# EAGLE schematic BMBurner V1.0 (EAGLE 8.4.0)
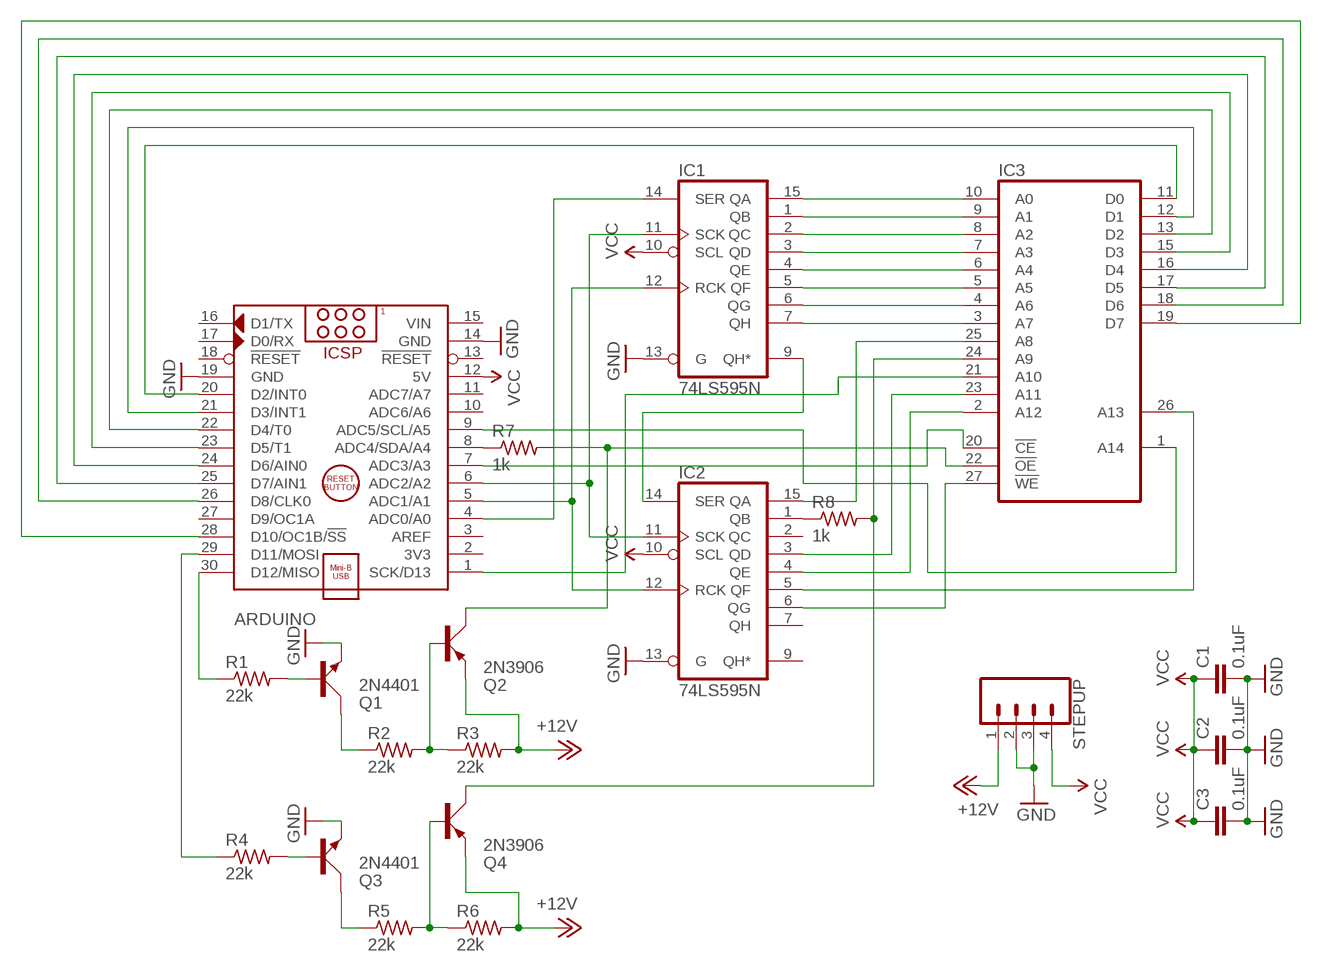
[diagram p0: schematic, sheet 1]

## Parts
ARDUINO  ARDUINO_NANO  [ARDUINO_NANO]
C1  0.1uF  CAPPTH  [CAP-PTH-SMALL]
C2  0.1uF  CAPPTH  [CAP-PTH-SMALL]
C3  0.1uF  CAPPTH  [CAP-PTH-SMALL]
IC1  74LS595N  [DIL16]
IC2  74LS595N  [DIL16]
IC3  2864  [DIL28]
Q1  2N4401  2N2222  [TO18A]
Q2  2N3906  [TO92D]
Q3  2N4401  2N2222  [TO18A]
Q4  2N3906  [TO92D]
R1  22k  R-US_0207/10  [0207/10]
R2  22k  R-US_0207/10  [0207/10]
R3  22k  R-US_0207/10  [0207/10]
R4  22k  R-US_0207/10  [0207/10]
R5  22k  R-US_0207/10  [0207/10]
R6  22k  R-US_0207/10  [0207/10]
R7  1k  R-US_0207/10  [0207/10]
R8  1k  R-US_0207/10  [0207/10]
STEPUP  CONN_04  [1X04]

## Nets
+12V: Q2.E Q4.E R3.2 R6.2 STEPUP.1
GND: ARDUINO.14(GND) ARDUINO.19(GND) C1.2 C2.2 C3.2 IC1.13(G) IC2.13(G) Q1.E Q3.E STEPUP.2 STEPUP.3
N$1: ARDUINO.7(ADC3/A3) IC3.20(!CE)
N$2: ARDUINO.29(D11/MOSI) R4.1
N$3: ARDUINO.6(ADC2/A2) IC1.11(SCK) IC2.11(SCK)
N$4: IC2.4(QE) IC3.2(A12)
N$5: ARDUINO.9(ADC5/SCL/A5) IC3.1(A14)
N$6: IC3.22(!OE) Q2.C R7.2
N$7: IC2.6(QG) IC3.27(!WE)
N$8: Q1.C R2.1
N$9: ARDUINO.1(SCK/D13) IC3.21(A10)
N$10: ARDUINO.30(D12/MISO) R1.1
N$11: Q3.C R5.1
N$37: ARDUINO.8(ADC4/SDA/A4) R7.1
N$39: Q1.B R1.2
N$45: Q2.B R2.2 R3.1
N$46: Q3.B R4.2
N$48: Q4.B R5.2 R6.1
N$52: IC3.24(A9) Q4.C R8.2
N$53: IC2.1(QB) R8.1
N$54: IC2.15(QA) IC3.25(A8)
N$57: ARDUINO.5(ADC1/A1) IC1.12(RCK) IC2.12(RCK)
N$58: ARDUINO.4(ADC0/A0) IC1.14(SER)
N$59: IC1.9(QH*) IC2.14(SER)
N$60: ARDUINO.20(D2/INT0) IC3.11(D0)
N$61: ARDUINO.21(D3/INT1) IC3.12(D1)
N$62: ARDUINO.22(D4/T0) IC3.13(D2)
N$63: ARDUINO.23(D5/T1) IC3.15(D3)
N$64: ARDUINO.24(D6/AIN0) IC3.16(D4)
N$65: ARDUINO.25(D7/AIN1) IC3.17(D5)
N$66: ARDUINO.26(D8/CLK0) IC3.18(D6)
N$67: ARDUINO.28(D10/OC1B/!SS) IC3.19(D7)
N$68: IC1.15(QA) IC3.10(A0)
N$69: IC1.1(QB) IC3.9(A1)
N$70: IC1.2(QC) IC3.8(A2)
N$71: IC1.3(QD) IC3.7(A3)
N$72: IC1.4(QE) IC3.6(A4)
N$73: IC1.5(QF) IC3.5(A5)
N$74: IC1.6(QG) IC3.4(A6)
N$75: IC1.7(QH) IC3.3(A7)
N$76: IC2.3(QD) IC3.23(A11)
N$80: IC2.5(QF) IC3.26(A13)
VCC: ARDUINO.12(5V) C1.1 C2.1 C3.1 IC1.10(SCL) IC2.10(SCL) STEPUP.4
Unconnected: ARDUINO.2(3V3) ARDUINO.3(AREF) ARDUINO.10(ADC6/A6) ARDUINO.11(ADC7/A7) ARDUINO.13(!RESET) ARDUINO.16(D1/TX) ARDUINO.17(D0/RX) ARDUINO.18(!RESET) ARDUINO.27(D9/OC1A) IC2.2(QC) IC2.7(QH) IC2.9(QH*)

## Power pins joined to a net without a drawn wire
GND: IC1.8(GND) IC2.8(GND) IC3.14(GND)
VCC: IC1.16(VCC) IC2.16(VCC) IC3.28(VCC)
VIN: ARDUINO.15(VIN)

## Library data of the parts
ARDUINO = ArduinoNanoV30:ARDUINO_NANO: Arduino Nano V3.0 Module Overview: The Arduino Nano is a small, complete, and breadboard-friendly board based on the ATmega328 (Arduino Nano 3.x) or ATmega168 (Arduino Nano 2.x). It has more or less the same functionality of the Arduino Duemilanove, but in a different package. It lacks only a DC power jack, and works with a Mini-B USB cable instead of a standard one. The Nano was designed and is being produced by Gravitech <http://www.gravitech.us/arna30wiatp.html>. General specifications: Item Value Microcontroller Atmel ATmega168 or ATmega328 Operating Voltage (logic level) 5 V Input Voltage (recommended) 7-12 V Input Voltage (limits) 6-20 V Digital I/O Pins 14 (of which 6 provide PWM output) Analog Input Pins 8 DC Current per I/O Pin 40 mA Flash Memory 16 KB (ATmega168) or 32 KB (ATmega328) of which 2 KB used by bootloader SRAM 1 KB (ATmega168) or 2 KB (ATmega328) EEPROM 512 bytes (ATmega168) or 1 KB (ATmega328) Clock Speed 16 MHz Dimensions (Inches) 0.73" x 1.70" Dimensions (mm) 18mm x 45mm Overall height About 9 mm (not including pins) Weigth 5 g Power: The Arduino Nano can be powered via the Mini-B USB connection, 6-20V unregulated external power supply (pin 30), or 5V regulated external power supply (pin 27). The power source is automatically selected to the highest voltage source. Memory: The ATmega168 has 16 KB of flash memory for storing code (of which 2 KB is used for the bootloader); the ATmega328 has 32 KB, (also with 2 KB used for the bootloader). The ATmega168 has 1 KB of SRAM and 512 bytes of EEPROM (which can be read and written with the EEPROM library); the ATmega328 has 2 KB of SRAM and 1 KB of EEPROM. Input and Output: Each of the 14 digital pins on the Nano can be used as an input or output, using pinMode(), digitalWrite(), and digitalRead() functions. They operate at 5 volts. Each pin can provide or receive a maximum of 40 mA and has an internal pull-up resistor (disconnected by default) of 20-50 kOhms. In addition, some pins have specialized functions. Visit Arduino - ArduinoBoardNano <https://www.arduino.cc/en/Main/ArduinoBoardNano>
C1-C3 = SparkFun:CAP: Capacitor Standard 0603 ceramic capacitor, and 0.1" leaded capacitor.
IC1 IC2 = 74xx-us:74*595: 8-bit SHIFT REGISTER, output latch; SPICEPREFIX: X
IC3 = modded_memory:2864: MEMORY
Q1 Q3 = transistor-small-signal:2N2222: NPN TRANSISTOR
Q2 Q4 = transistor-small-signal:2N3906: PNP TRANSISTOR
R1 = resistor:R-US_: RESISTOR, American symbol; SPICEPREFIX: R
R2-R8 = resistor:R-US_: RESISTOR, American symbol
STEPUP = SparkFun-Connectors:CONN_04: Multi connection point. Often used as Generic Header-pin footprint for 0.1 inch spaced/style header connections On any of the 0.1 inch spaced packages, you can populate with these: Break Away Headers - Straight <https://www.sparkfun.com/products/116> (PRT-00116) Break Away Male Headers - Right Angle <https://www.sparkfun.com/products/553> (PRT-00553) Female Headers <https://www.sparkfun.com/products/115> (PRT-00115) Break Away Headers - Machine Pin <https://www.sparkfun.com/products/117> (PRT-00117) Break Away Female Headers - Swiss Machine Pin <https://www.sparkfun.com/products/743> (PRT-00743) For SCREWTERMINALS and SPRING TERMINALS visit here: Screw Terimnals on SparkFun.com <https://www.sparkfun.com/search/results?term=Screw+Terminals> (5mm/3.5mm/2.54mm spacing) This device is also useful as a general connection point to wire up your design to another part of your project. Our various solder wires solder well into these plated through hole pads. Hook-Up Wire - Assortment (Stranded, 22 AWG) <https://www.sparkfun.com/products/11375> (PRT-11375) Hook-Up Wire - Assortment (Solid Core, 22 AWG) <https://www.sparkfun.com/products/11367> (PRT-11367) View the entire wire category on our website here <https://www.sparkfun.com/categories/141> Special notes: Molex polarized connector foot print use with SKU : PRT-08231 with associated crimp pins and housings. 1MM SMD Version SKU: PRT-10208; PROD_ID: CONN-09696

## Net classes
0 default: clearance 0.205 mm